# EAGLE design Beating Heart (EAGLE 9.4.2)
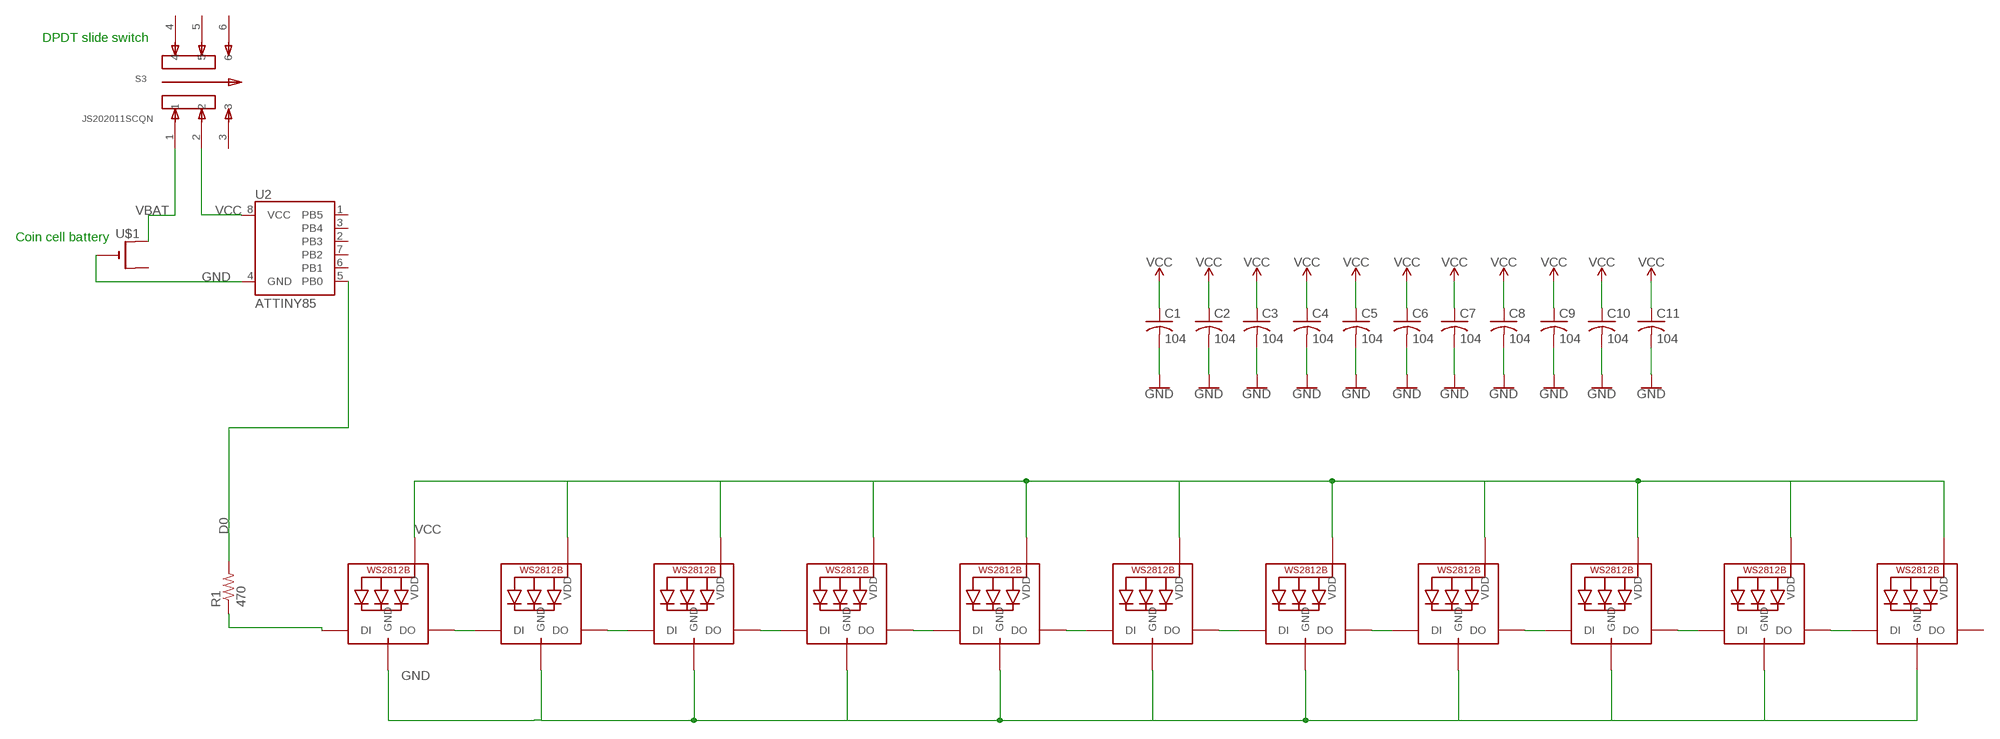
[diagram p0: schematic, sheet 1]

## Parts
C1  104  C-USC0805K  [C0805K]
C2  104  C-USC0805K  [C0805K]
C3  104  C-USC0805K  [C0805K]
C4  104  C-USC0805K  [C0805K]
C5  104  C-USC0805K  [C0805K]
C6  104  C-USC0805K  [C0805K]
C7  104  C-USC0805K  [C0805K]
C8  104  C-USC0805K  [C0805K]
C9  104  C-USC0805K  [C0805K]
C10  104  C-USC0805K  [C0805K]
C11  104  C-USC0805K  [C0805K]
LED1  WS2812B5050  [WS2812B]
LED2  WS2812B5050  [WS2812B]
LED3  WS2812B5050  [WS2812B]
LED4  WS2812B5050  [WS2812B]
LED5  WS2812B5050  [WS2812B]
LED6  WS2812B5050  [WS2812B]
LED7  WS2812B5050  [WS2812B]
LED8  WS2812B5050  [WS2812B]
LED9  WS2812B5050  [WS2812B]
LED10  WS2812B5050  [WS2812B]
LED11  WS2812B5050  [WS2812B]
R1  470  R-US_M0805  [M0805]
S3  JS202011SCQN  [SW_JS202011SCQN]
U2  ATTINY85  [ATTINY85]
U$1  CR1220SMT  [CR1220-SMD]

## Nets
D0: R1.2 U2.5(PB0)
GND: C1.2 C2.2 C3.2 C4.2 C5.2 C6.2 C7.2 C8.2 C9.2 C10.2 C11.2 LED1.3-GND(GND) LED2.3-GND(GND) LED3.3-GND(GND) LED4.3-GND(GND) LED5.3-GND(GND) LED6.3-GND(GND) LED7.3-GND(GND) LED8.3-GND(GND) LED9.3-GND(GND) LED10.3-GND(GND) LED11.3-GND(GND) U2.4(GND) U$1.-
N$3: LED1.2-DOUT(DO) LED2.4-DIN(DI)
N$4: LED2.2-DOUT(DO) LED3.4-DIN(DI)
N$5: LED3.2-DOUT(DO) LED4.4-DIN(DI)
N$6: LED4.2-DOUT(DO) LED5.4-DIN(DI)
N$7: LED5.2-DOUT(DO) LED6.4-DIN(DI)
N$8: LED6.2-DOUT(DO) LED7.4-DIN(DI)
N$9: LED7.2-DOUT(DO) LED8.4-DIN(DI)
N$10: LED8.2-DOUT(DO) LED9.4-DIN(DI)
N$11: LED9.2-DOUT(DO) LED10.4-DIN(DI)
N$12: LED10.2-DOUT(DO) LED11.4-DIN(DI)
N$13: LED1.4-DIN(DI) R1.1
VBAT: S3.1 U$1.+$1(+)
VCC: C1.1 C2.1 C3.1 C4.1 C5.1 C6.1 C7.1 C8.1 C9.1 C10.1 C11.1 LED1.1-VDD(VDD) LED2.1-VDD(VDD) LED3.1-VDD(VDD) LED4.1-VDD(VDD) LED5.1-VDD(VDD) LED6.1-VDD(VDD) LED7.1-VDD(VDD) LED8.1-VDD(VDD) LED9.1-VDD(VDD) LED10.1-VDD(VDD) LED11.1-VDD(VDD) S3.2 U2.8(VCC)
Unconnected: LED11.2-DOUT(DO) S3.3 S3.4 S3.5 S3.6 U2.1(PB5) U2.2(PB3) U2.3(PB4) U2.6(PB1) U2.7(PB2) U$1.+$2(+1)

## Notes on the sheet
- DPDT slide switch
- Coin cell battery

## Library data of the parts
C1-C11 = adafruit:C-US: CAPACITOR, American symbol
LED1-LED11 = adafruit:WS2812B
R1 = adafruit:R-US_: RESISTOR, American symbol
S3 = JS202011SCQN:JS202011SCQN: JS Series DPDT On-On Gull Wing Surface Mount Subminiature Slide Switch; DESCRIPTION: Slide Switch DPDT Surface Mount; DIGI-KEY_PART_NUMBER: 401-2002-1-ND; DIGI-KEY_PURCHASE_URL: https://www.digikey.com/product-detail/en/c-k/JS202011SCQN/401-2002-1-ND/1640098?utm_source=snapeda&utm_medium=aggregator&utm_campaign=symbol; MF: C&K; MP: JS202011SCQN; PACKAGE: None
U2 = SparkFun-IC-Microcontroller:ATTINY85; PROD_ID: IC-09092
U$1 = adafruit:CR1220: CR1216/CR1220/CR1225 12mm 3V lithium coin cell Great for battery packup. Both SMT and THM holders. Note the THM package has the ground pads on both sides of the PCB so that the masks are the same - this reduces the cost

## Board
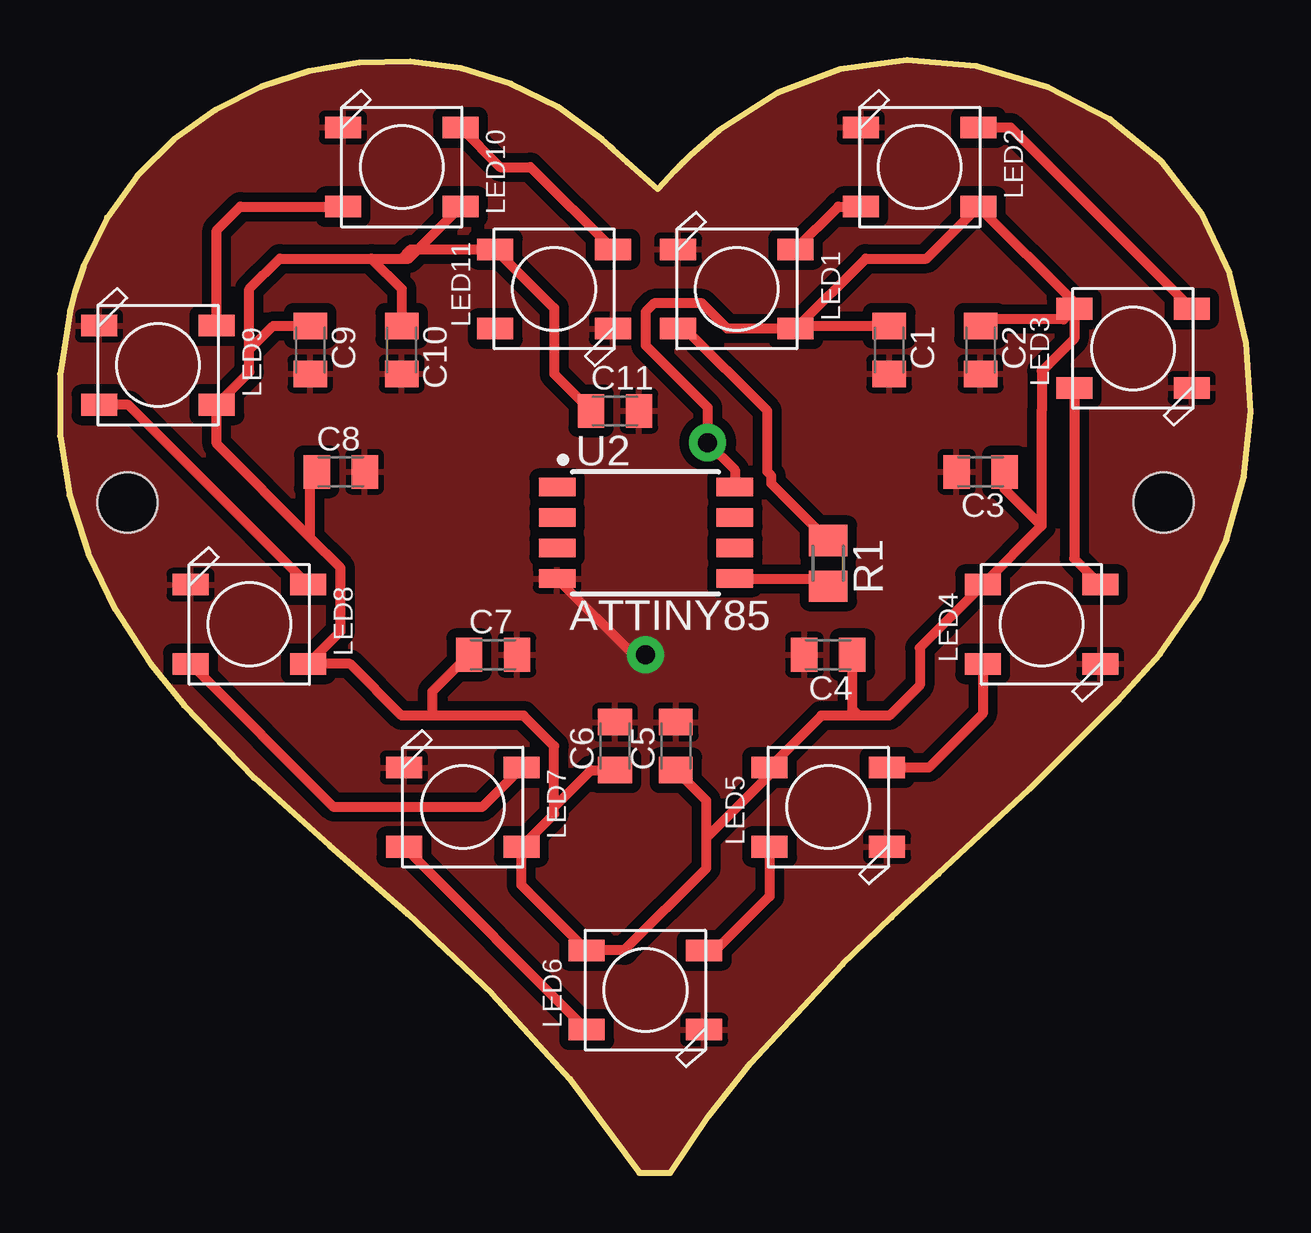
[diagram p1: board, top side]
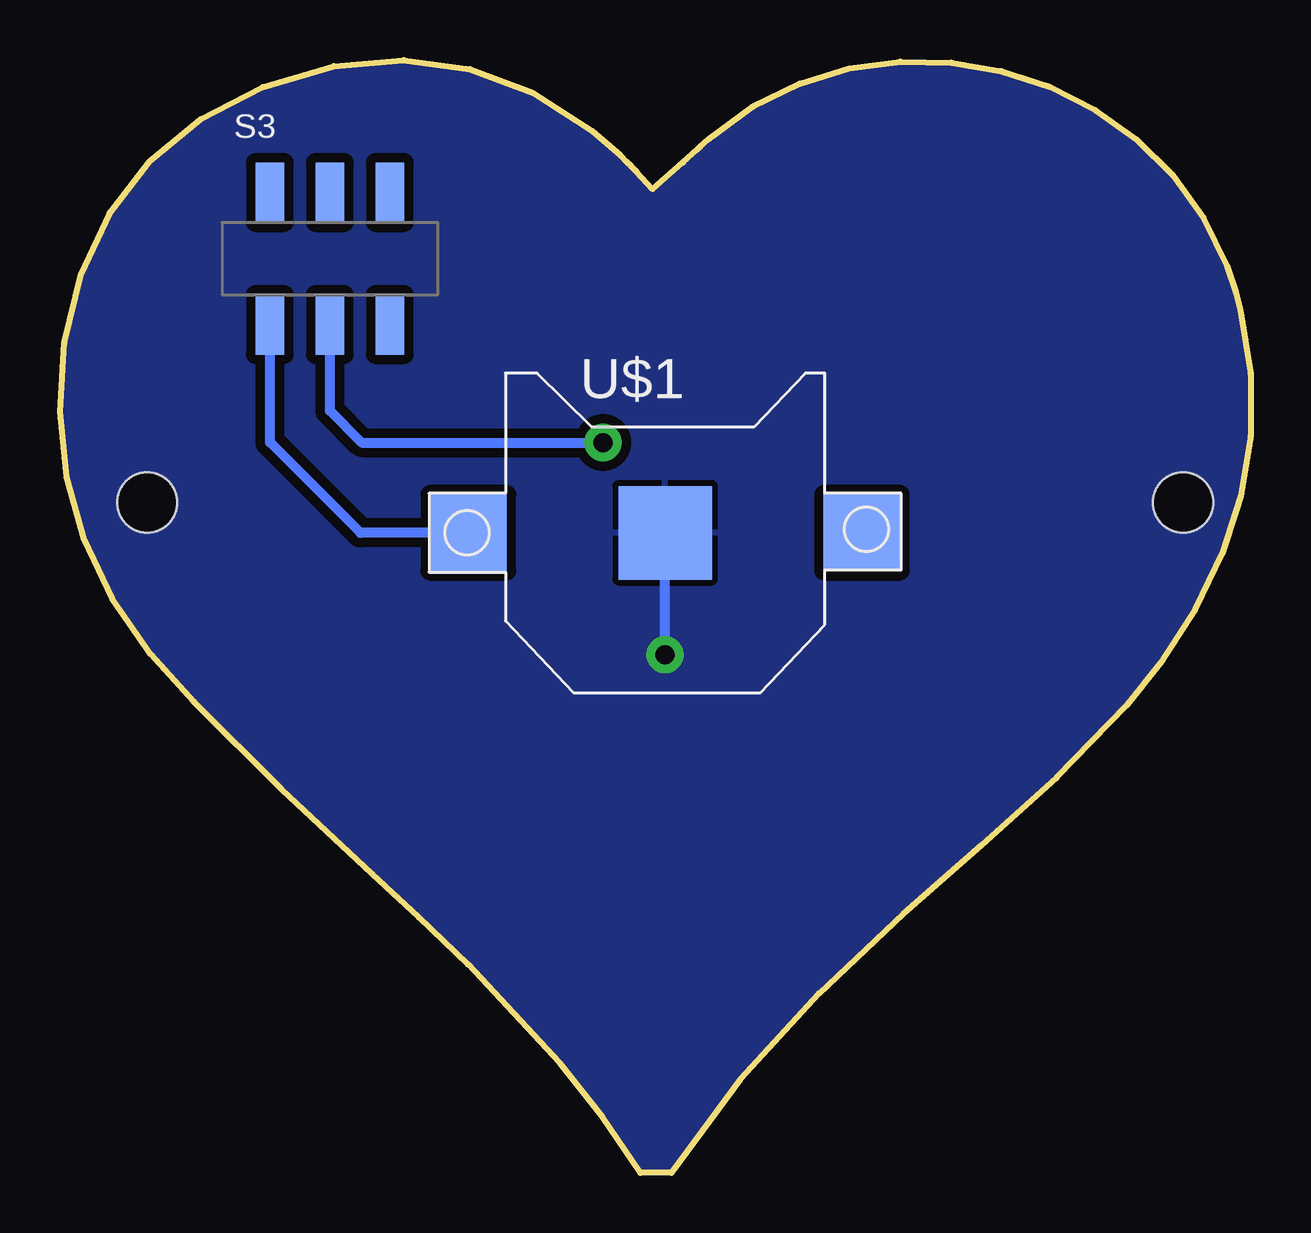
[diagram p2: board, bottom side, seen from below]

Size 49.63 x 46.37 mm. Coordinates in mm from the lower left corner, seen from the top.
Outline: 0.42,35.93 0,33.28 0,30.71 0.4,28.22 1.18,25.81 2.31,23.48 3.77,21.23 5.17,19.48 8.09,16.46 11.22,13.66 14.48,10.8 18,7.47 21.26,3.9 24.15,0 25.44,0 27.03,2.35 28.78,4.57 32.62,8.69 34.66,10.65 36.62,12.46 40.4,15.99 44.05,19.63 45.85,21.62 47.45,23.92 48.62,26.38 49.35,28.99 49.63,31.72 49.45,34.56 48.75,37.46 47.56,39.99 45.9,42.15 43.76,43.9 41.17,45.24 38.2,46.12 35.3,46.37 32.54,46 29.92,45.01 27.45,43.41 26.27,42.39 25.99,42.12 25.87,42 25.82,41.95 25.62,41.74 24.92,40.99 23.66,42.11 23.06,42.65 22.95,42.75 22.59,43.07 20.76,44.41 18.79,45.39 16.72,46.02 14.61,46.3 12.48,46.26 10.39,45.91 8.38,45.25 6.48,44.3 4.76,43.06 3.23,41.56 1.96,39.8 0.99,37.79 0.62,36.7 0.42,35.93
Copper layers (1*16): Top 0.035mm / dielectric 1.5mm / Bottom 0.035mm
Design rules "OthermillDRC_1_64_v2": minimum track width 16mil, minimum drill 31mil, track to track 0.39878125mm, track to pad 0.39878125mm, pad to pad 0.39878125mm, via to via 0.39878125mm, smd to smd 0mil, copper to edge 0mil, drill to drill 1mil, minimum pad ring 0mil, minimum via ring 15mil, stop-mask expansion 1mil, vias tented up to drill 30mil, thermal gap 10mil
Holes 2.5 mm at 2.81,27.94 45.99,27.94

### Footprints (pad centres in the part's own frame; a part is rotated, then mirrored left to right if it is on the bottom)
C0805K = smd 1.1 x 1.4: 1 -1,0; 2 1,0
WS2812B = smd 1.5 x 0.9: 1-VDD 2.45,-1.65; 2-DOUT 2.45,1.65; 3-GND -2.45,1.65; 4-DIN -2.45,-1.65
M0805 = smd 1.3 x 1.6: 1 -0.95,0; 2 0.95,0
SW_JS202011SCQN = smd 1.2 x 2.5: 1 -2.5,-2.75; 2 0,-2.75; 3 2.5,-2.75; 4 -2.5,2.75; 5 0,2.75; 6 2.5,2.75
ATTINY85 = smd 1.524 x 0.762: 1 -3.683,1.905; 2 -3.683,0.635; 3 -3.683,-0.635; 4 -3.683,-1.905; 5 3.727,-1.905; 6 3.727,-0.635; 7 3.727,0.635; 8 3.727,1.905
CR1220-SMD = smd 3.2 x 3.2: +$1 -8.2,0; +$2 8.2,0 | smd 3.9 x 3.9: - 0,0

### Placement (x,y rotation side)
C1  34.56,34.29 270 top
C2  38.37,34.29 270 top
C3  38.37,29.21 180 top
C4  32.02,21.59 180 top
C5  25.67,17.78 90 top
C6  23.13,17.78 90 top
C7  18.05,21.59 0 top
C8  11.7,29.21 0 top
C9  10.43,34.29 270 top
C10  14.24,34.29 270 top
C11  23.13,31.75 0 top
LED1  28.21,36.83 0 top
LED2  35.83,41.91 0 top
LED3  44.72,34.35 180 top
LED4  40.91,22.86 180 top
LED5  32.02,15.24 180 top
LED6  24.4,7.62 180 top
LED7  16.78,15.24 0 top
LED8  7.89,22.86 0 top
LED9  4.08,33.65 0 top
LED10  14.24,41.91 0 top
LED11  20.59,36.83 180 top
R1  32.02,25.4 270 top
S3  38.37,38.1 0 bottom
U2  24.4,26.67 0 top
U$1  24.4,26.67 0 bottom

### Tracks (layer width: path | path; a pad name or v marks a point on that pad's centre or on a via)
D0
  Top 0.406: U2.5 31.71,24.77 R1.2
GND  (via drill 0.79)
  Top 0.406: U2.4 23.9,21.59 v24.4,21.59
  Bottom 0.406: v24.4,21.59 U$1.-
  pour Top: 0.42,35.93 0,33.28 0,30.71 0.4,28.22 1.18,25.81 2.31,23.48 3.77,21.23 5.17,19.48 8.09,16.46 11.22,13.66 14.48,10.8 18,7.47 21.26,3.9 24.15,0 25.44,0 27.03,2.35 28.78,4.57 32.62,8.69 34.66,10.65 36.62,12.46 40.4,15.99 44.05,19.63 45.85,21.62 47.45,23.92 48.62,26.38 49.35,28.99 49.63,31.72 49.45,34.56 48.75,37.46 47.56,39.99 45.9,42.15 43.76,43.9 41.17,45.24 38.2,46.12 35.3,46.37 32.54,46 29.92,45.01 27.45,43.41 26.27,42.39 25.99,42.12 25.87,42 25.82,41.95 25.62,41.74 24.92,40.99 23.66,42.11 23.06,42.65 22.95,42.75 22.59,43.07 20.76,44.41 18.79,45.39 16.72,46.02 14.61,46.3 12.48,46.26 10.39,45.91 8.38,45.25 6.48,44.3 4.76,43.06 3.23,41.56 1.96,39.8 0.99,37.79 0.62,36.7
  pour Bottom: 0.42,35.93 0,33.28 0,30.71 0.4,28.22 1.18,25.81 2.31,23.48 3.77,21.23 5.17,19.48 8.09,16.46 11.22,13.66 14.48,10.8 18,7.47 21.26,3.9 24.15,0 25.44,0 27.03,2.35 28.78,4.57 32.62,8.69 34.66,10.65 36.62,12.46 40.4,15.99 44.05,19.63 45.85,21.62 47.45,23.92 48.62,26.38 49.35,28.99 49.63,31.72 49.45,34.56 48.75,37.46 47.56,39.99 45.9,42.15 43.76,43.9 41.17,45.24 38.2,46.12 35.3,46.37 32.54,46 29.92,45.01 27.45,43.41 26.27,42.39 25.99,42.12 25.87,42 25.82,41.95 25.62,41.74 24.92,40.99 23.66,42.11 23.06,42.65 22.95,42.75 22.59,43.07 20.76,44.41 18.79,45.39 16.72,46.02 14.61,46.3 12.48,46.26 10.39,45.91 8.38,45.25 6.48,44.3 4.76,43.06 3.23,41.56 1.96,39.8 0.99,37.79 0.62,36.7
N$3
  Top 0.406: LED1.2-DOUT 32.44,40.26 LED2.4-DIN
N$4
  Top 0.406: LED2.2-DOUT 39.62,43.56 LED3.4-DIN
N$5
  Top 0.406: LED4.4-DIN 42.27,25.6 LED3.2-DOUT
N$6
  Top 0.406: LED4.2-DOUT 38.46,19.14 36.21,16.89 LED5.4-DIN
N$7
  Top 0.406: LED5.2-DOUT 29.57,11.52 27.32,9.27 LED6.4-DIN
N$8
  Top 0.406: LED6.2-DOUT LED7.4-DIN
N$9
  Top 0.406: LED7.2-DOUT 17.58,15.24 11.41,15.24 LED8.4-DIN
N$10
  Top 0.406: LED8.2-DOUT 2.85,32 LED9.4-DIN
N$11
  Top 0.406: LED9.2-DOUT 6.53,39.28 7.51,40.26 LED10.4-DIN
N$12
  Top 0.406: LED10.2-DOUT 18.34,41.91 19.61,41.91 LED11.4-DIN
N$13
  Top 0.406: R1.1 29.65,28.72 29.65,29.05 29.48,29.22 29.48,31.75 26.05,35.18 LED1.4-DIN
VBAT
  Bottom 0.406: U$1.+$1 37.1,26.67 40.87,30.44 S3.1
VCC  (via drill 0.79)
  Top 0.406: LED1.1-VDD 30.77,35.29 C1.1 | LED1.1-VDD 33.58,38.1 36.12,38.1 LED2.1-VDD 42.27,36.27 LED3.1-VDD | C2.1 38.37,35.56 41.83,35.56 LED3.1-VDD | LED3.1-VDD 42.27,34.76 40.92,33.4 40.92,31.76 40.91,31.75 40.91,26.96 | 40.91,26.96 LED4.1-VDD 35.83,21.88 35.83,20.32 34.56,19.05 33.29,19.05 | 40.91,26.96 39.37,28.5 C3.1 | 33.29,19.05 31.73,19.05 LED5.1-VDD 29.57,16.6 26.94,13.97 | 33.29,19.05 33.02,19.32 C4.1 | 26.94,13.97 26.94,12.7 23.51,9.27 LED6.1-VDD 19.23,11.99 LED7.1-VDD 20.59,14.95 20.59,15.24 | 26.94,13.97 26.94,15.51 C5.1 | 20.59,15.24 20.59,17.78 19.32,19.05 15.51,19.05 | 20.59,15.24 22.13,16.78 C6.1 | 15.51,19.05 15.51,20.05 C7.1 | 15.51,19.05 14.24,19.05 12.08,21.21 LED8.1-VDD 11.7,22.56 11.7,25.21 10.43,26.47 | 10.43,26.47 6.53,30.37 LED9.1-VDD 7.89,33.36 7.89,34.29 | 10.43,26.47 10.43,28.94 C8.1 | 7.89,34.29 7.89,36.83 9.16,38.1 12.97,38.1 | LED10.1-VDD 14.53,38.1 14.24,38.1 | 12.97,38.1 14.24,38.1 | 14.24,38.1 14.62,38.48 LED11.1-VDD 20.59,36.03 20.59,33.29 C11.1 | 7.89,34.29 8.89,35.29 C9.1 | 12.97,38.1 14.24,36.83 C10.1 | U2.8 28.13,29.29 v26.99,30.43 26.99,31.9 24.41,34.48 24.41,35.88 24.77,36.23 26.76,36.23 27.82,35.18 LED1.1-VDD
  Bottom 0.406: v26.99,30.43 37.05,30.43 38.37,31.75 S3.2